# Altium schematic sheet Ejercicio1.SchDoc
size A3
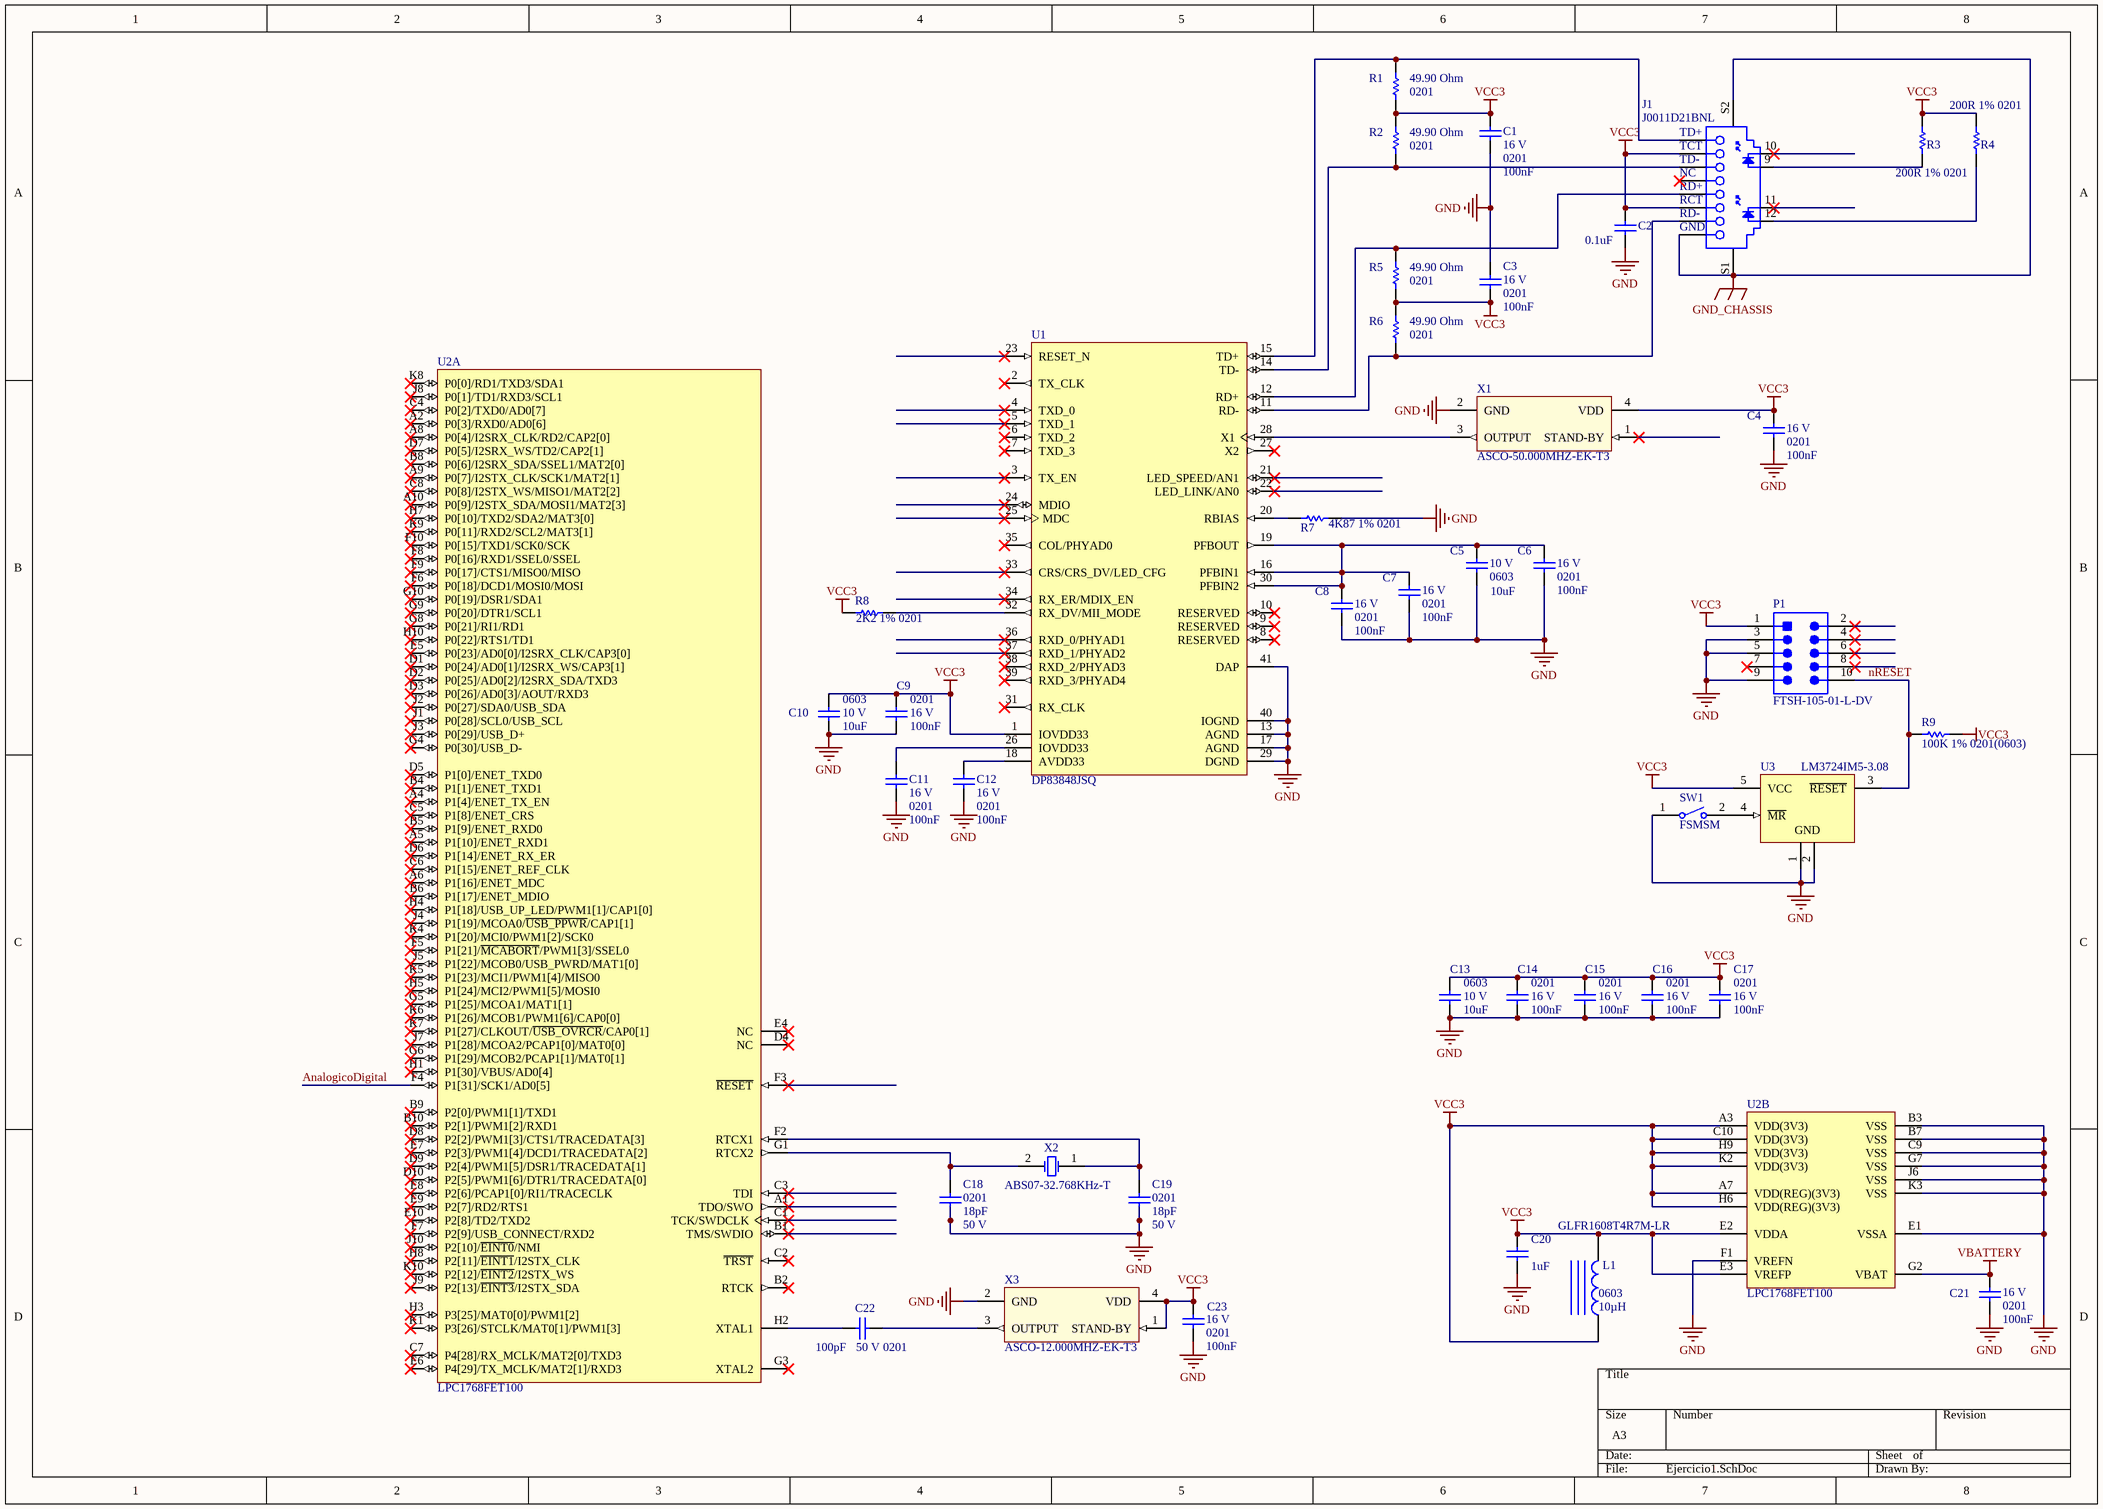
[diagram p0: Ejercicio1.SchDoc]

## Parts
C1  value 100nF  Rated Voltage: 16 V  Case-EIA: 0201  [CAPC0201(0603)33_N]  (hidden comment: CAP 100nF 16V 0201(0603))
C2  Capacitance: 0.1uF  [MURA-0603_H_0.9_L]  (hidden comment: GRM188R71C104KA01D)
C3  value 100nF  Rated Voltage: 16 V  Case-EIA: 0201  [CAPC0201(0603)33_N]  (hidden comment: CAP 100nF 16V 0201(0603))
C4  value 100nF  Rated Voltage: 16 V  Case-EIA: 0201  [CAPC0201(0603)33_N]  (hidden comment: CAP 100nF 16V 0201(0603))
C5  value 10uF  Rated Voltage: 10 V  Case-EIA: 0603  [CAPC0603(1608)100_N]  (hidden comment: CAP 10uF 10V 0603(1608))
C6  value 100nF  Rated Voltage: 16 V  Case-EIA: 0201  [CAPC0201(0603)33_N]  (hidden comment: CAP 100nF 16V 0201(0603))
C7  value 100nF  Rated Voltage: 16 V  Case-EIA: 0201  [CAPC0201(0603)33_N]  (hidden comment: CAP 100nF 16V 0201(0603))
C8  value 100nF  Rated Voltage: 16 V  Case-EIA: 0201  [CAPC0201(0603)33_N]  (hidden comment: CAP 100nF 16V 0201(0603))
C9  value 100nF  Rated Voltage: 16 V  Case-EIA: 0201  [CAPC0201(0603)33_N]  (hidden comment: CAP 100nF 16V 0201(0603))
C10  value 10uF  Rated Voltage: 10 V  Case-EIA: 0603  [CAPC0603(1608)100_N]  (hidden comment: CAP 10uF 10V 0603(1608))
C11  value 100nF  Rated Voltage: 16 V  Case-EIA: 0201  [CAPC0201(0603)33_N]  (hidden comment: CAP 100nF 16V 0201(0603))
C12  value 100nF  Rated Voltage: 16 V  Case-EIA: 0201  [CAPC0201(0603)33_N]  (hidden comment: CAP 100nF 16V 0201(0603))
C13  value 10uF  Rated Voltage: 10 V  Case-EIA: 0603  [CAPC0603(1608)100_N]  (hidden comment: CAP 10uF 10V 0603(1608))
C14  value 100nF  Rated Voltage: 16 V  Case-EIA: 0201  [CAPC0201(0603)33_N]  (hidden comment: CAP 100nF 16V 0201(0603))
C15  value 100nF  Rated Voltage: 16 V  Case-EIA: 0201  [CAPC0201(0603)33_N]  (hidden comment: CAP 100nF 16V 0201(0603))
C16  value 100nF  Rated Voltage: 16 V  Case-EIA: 0201  [CAPC0201(0603)33_N]  (hidden comment: CAP 100nF 16V 0201(0603))
C17  value 100nF  Rated Voltage: 16 V  Case-EIA: 0201  [CAPC0201(0603)33_N]  (hidden comment: CAP 100nF 16V 0201(0603))
C18  value 18pF  Case-EIA: 0201  Rated Voltage: 50 V  [CAPC0201(0603)33_M]  (hidden comment: CAP 18pF 50V 0201(0603))
C19  value 18pF  Case-EIA: 0201  Rated Voltage: 50 V  [CAPC0201(0603)33_M]  (hidden comment: CAP 18pF 50V 0201(0603))
C20  value 1uF  [CAPC0603(1608)100_N]  (hidden comment: CAP 1uF 50V 0603(1608))
C21  value 100nF  Rated Voltage: 16 V  Case-EIA: 0201  [CAPC0201(0603)33_N]  (hidden comment: CAP 100nF 16V 0201(0603))
C22  value 100pF  Rated Voltage: 50 V  Case-EIA: 0201  [CAPC0201(0603)33_M]  (hidden comment: CAP 100pF 50V 0201(0603))
C23  value 100nF  Rated Voltage: 16 V  Case-EIA: 0201  [CAPC0201(0603)33_N]  (hidden comment: CAP 100nF 16V 0201(0603))
J1  J0011D21BNL  [PULS-J00XXD21XNL-B-12]
L1  GLFR1608T4R7M-LR  Inductance: 10µH  Package Reference: 0603  [INDC1608X100X35NL20T15]
P1  FTSH-105-01-L-DV  [SMTC-FTSH-105-01-L-DV_V]
R1  value 49.90 Ohm  Case-EIA: 0201  [RESC0201(0603)_L]  (hidden comment: 49R9 1% 0201(0603))
R2  value 49.90 Ohm  Case-EIA: 0201  [RESC0201(0603)_L]  (hidden comment: 49R9 1% 0201(0603))
R3  200R 1% 0201  [RESC0201(0603)_M]
R4  200R 1% 0201  [RESC0201(0603)_M]
R5  value 49.90 Ohm  Case-EIA: 0201  [RESC0201(0603)_L]  (hidden comment: 49R9 1% 0201(0603))
R6  value 49.90 Ohm  Case-EIA: 0201  [RESC0201(0603)_L]  (hidden comment: 49R9 1% 0201(0603))
R7  4K87 1% 0201  [RESC0201(0603)_L]
R8  2K2 1% 0201  [RESC0201(0603)_N]
R9  100K 1% 0201(0603)  [RESC0201(0603)_L]
SW1  FSMSM  [TECO-FSMSM-2_V]
U1  DP83848JSQ  [SQA40B]
U2  LPC1768FET100  [SOT926-1]  (parts A,B of 2)
U3  LM3724IM5-3.08  [MF05A_N]
X1  ASCO-50.000MHZ-EK-T3  [ABRA-ASCO-50.000MHZ-EK-T3-4_V]
X2  ABS07-32.768KHz-T  [ABRA-ABS07-2_V]
X3  ASCO-12.000MHZ-EK-T3  [ABRA-ASCO-50.000MHZ-EK-T3-4_V]

## Nets
GND: C1.2 C2.1 C3.1 C4.2 C5.2 C6.2 C7.2 C8.2 C9.1 C10.1 C11.2 C12.2 C13.1 C14.1 C15.1 C16.1 C17.1 C18.1 C19.1 C20.1 C21.2 C23.2 P1.3 P1.5 P1.9 R7.2 SW1.1 U1.13(AGND) U1.17(AGND) U1.29(DGND) U1.40(IOGND) U1.41(DAP) U2.B3(VSS) U2.B7(VSS) U2.C9(VSS) U2.E1(VSSA) U2.F1(VREFN) U2.G7(VSS) U2.J6(VSS) U2.K3(VSS) U3.1(GND) U3.2(GND) X1.2(GND) X3.2(GND)
GND_CHASSIS: J1.8(CHS_GROUND) J1.S1 J1.S2
VBATTERY: C21.1 U2.G2(VBAT)
VCC3: C1.1 C2.2 C3.2 C4.1 C9.2 C10.2 C13.2 C14.2 C15.2 C16.2 C17.2 C20.2 C23.1 J1.4(TCT) J1.5(RCT) L1.1 L1.2 P1.1 R1.1 R2.2 R3.2 R4.2 R5.1 R6.2 R8.2 R9.1 U1.1(IOVDD33) U2.A3(VDD(3V3)) U2.A7(VDD(REG)(3V3)) U2.C10(VDD(3V3)) U2.E2(VDDA) U2.E3(VREFP) U2.H6(VDD(REG)(3V3)) U2.H9(VDD(3V3)) U2.K2(VDD(3V3)) U3.5(VCC) X1.4(VDD) X3.1(STAND-BY) X3.4(VDD)
AnalogicoDigital: U2.F4(P1[31]/SCK1/AD0[5])
nRESET: P1.10 R9.2 U3.3(~{RESET})
NetC5_1: C5.1 C6.1 C7.1 C8.1 U1.16(PFBIN1) U1.19(PFBOUT) U1.30(PFBIN2)
NetC11_1: C11.1 U1.26(IOVDD33)
NetC12_1: C12.1 U1.18(AVDD33)
NetC18_2: C18.2 U2.G1(RTCX2) X2.2(X2)
NetC19_2: C19.2 U2.F2(RTCX1) X2.1(X1)
NetC22_1: C22.1 X3.3(OUTPUT)
NetC22_2: C22.2 U2.H2(XTAL1)
NetJ1_1: J1.1(TD+) R1.2 U1.15(TD+)
NetJ1_2: J1.2(TD-) R2.1 U1.14(TD-)
NetJ1_3: J1.3(RD+) R5.2 U1.12(RD+)
NetJ1_6: J1.6(RD-) R6.1 U1.11(RD-)
NetJ1_9: J1.9 R3.1
NetJ1_12: J1.12 R4.1
NetR7_1: R7.1 U1.20(RBIAS)
NetR8_1: R8.1 U1.32(RX_DV/MII_MODE)
NetSW1_2: SW1.2 U3.4(~{MR})
NetU1_28: U1.28(X1) X1.3(OUTPUT)

Not connected (* = marked no-connect by the designer): J1 7(NC)* 10* 11*; P1 2* 4* 6* 7* 8*; U1 2(TX_CLK)* 3(TX_EN)* 4(TXD_0)* 5(TXD_1)* 6(TXD_2)* 7(TXD_3)* 8(RESERVED)* 9(RESERVED)* 10(RESERVED)* 21(LED_SPEED/AN1)* 22(LED_LINK/AN0)* 23(RESET_N)* 24(MDIO)* 25(MDC)* 27(X2)* 31(RX_CLK)* 33(CRS/CRS_DV/LED_CFG)* 34(RX_ER/MDIX_EN)* 35(COL/PHYAD0)* 36(RXD_0/PHYAD1)* 37(RXD_1/PHYAD2)* 38(RXD_2/PHYAD3)* 39(RXD_3/PHYAD4)*; U2 A1(TDO/SWO)* A2(P0[3]/RXD0/AD0[6])* A4(P1[4]/ENET_TX_EN)* A5(P1[10]/ENET_RXD1)* A6(P1[16]/ENET_MDC)* A8(P0[4]/I2SRX_CLK/RD2/CAP2[0])* A9(P0[7]/I2STX_CLK/SCK1/MAT2[1])* A10(P0[9]/I2STX_SDA/MOSI1/MAT2[3])* B1(TMS/SWDIO)* B2(RTCK)* B4(P1[1]/ENET_TXD1)* B5(P1[9]/ENET_RXD0)* B6(P1[17]/ENET_MDIO)* B8(P0[6]/I2SRX_SDA/SSEL1/MAT2[0])* B9(P2[0]/PWM1[1]/TXD1)* B10(P2[1]/PWM1[2]/RXD1)* C1(TCK/SWDCLK)* C2(~{TRST})* C3(TDI)* C4(P0[2]/TXD0/AD0[7])* C5(P1[8]/ENET_CRS)* C6(P1[15]/ENET_REF_CLK)* C7(P4[28]/RX_MCLK/MAT2[0]/TXD3)* C8(P0[8]/I2STX_WS/MISO1/MAT2[2])* D1(P0[24]/AD0[1]/I2SRX_WS/CAP3[1])* D2(P0[25]/AD0[2]/I2SRX_SDA/TXD3)* D3(P0[26]/AD0[3]/AOUT/RXD3)* D4(NC)* D5(P1[0]/ENET_TXD0)* D6(P1[14]/ENET_RX_ER)* D7(P0[5]/I2SRX_WS/TD2/CAP2[1])* D8(P2[2]/PWM1[3]/CTS1/TRACEDATA[3])* D9(P2[4]/PWM1[5]/DSR1/TRACEDATA[1])* D10(P2[5]/PWM1[6]/DTR1/TRACEDATA[0])* E4(NC)* E5(P0[23]/AD0[0]/I2SRX_CLK/CAP3[0])* E6(P4[29]/TX_MCLK/MAT2[1]/RXD3)* E7(P2[3]/PWM1[4]/DCD1/TRACEDATA[2])* E8(P2[6]/PCAP1[0]/RI1/TRACECLK)* E9(P2[7]/RD2/RTS1)* E10(P2[8]/TD2/TXD2)* F3(~{RESET})* F5(P1[21]/~{MCABORT}/PWM1[3]/SSEL0)* F6(P0[18]/DCD1/MOSI0/MOSI)* F7(P2[9]/USB_CONNECT/RXD2)* F8(P0[16]/RXD1/SSEL0/SSEL)* F9(P0[17]/CTS1/MISO0/MISO)* F10(P0[15]/TXD1/SCK0/SCK)* G3(XTAL2)* G4(P0[30]/USB_D-)* G5(P1[25]/MCOA1/MAT1[1])* G6(P1[29]/MCOB2/PCAP1[1]/MAT0[1])* G8(P0[21]/RI1/RD1)* G9(P0[20]/DTR1/SCL1)* G10(P0[19]/DSR1/SDA1)* H1(P1[30]/VBUS/AD0[4])* H3(P3[25]/MAT0[0]/PWM1[2])* H4(P1[18]/USB_UP_LED/PWM1[1]/CAP1[0])* H5(P1[24]/MCI2/PWM1[5]/MOSI0)* H7(P0[10]/TXD2/SDA2/MAT3[0])* H8(P2[11]/~{EINT1}/I2STX_CLK)* H10(P0[22]/RTS1/TD1)* J1(P0[28]/SCL0/USB_SCL)* J2(P0[27]/SDA0/USB_SDA)* J3(P0[29]/USB_D+)* J4(P1[19]/MCOA0/~{USB_PPWR}/CAP1[1])* J5(P1[22]/MCOB0/USB_PWRD/MAT1[0])* J7(P1[28]/MCOA2/PCAP1[0]/MAT0[0])* J8(P0[1]/TD1/RXD3/SCL1)* J9(P2[13]/~{EINT3}/I2STX_SDA)* J10(P2[10]/~{EINT0}/NMI)* K1(P3[26]/STCLK/MAT0[1]/PWM1[3])* K4(P1[20]/MCI0/PWM1[2]/SCK0)* K5(P1[23]/MCI1/PWM1[4]/MISO0)* K6(P1[26]/MCOB1/PWM1[6]/CAP0[0])* K7(P1[27]/CLKOUT/~{USB_OVRCR}/CAP0[1])* K8(P0[0]/RD1/TXD3/SDA1)* K9(P0[11]/RXD2/SCL2/MAT3[1])* K10(P2[12]/~{EINT2}/I2STX_WS)*; X1 1(STAND-BY)*

## Notes on the sheet
- (in symbol CMP-2000-05321-1) GND

## Library data of the parts
C1 C3 C4 C6-C9 C11 C12 C14-C17 C21 C23 = CMP-1033-00663-1: CAP 100nF 16V ±10% 0201 (0603 Metric) Thickness 0.33mm SMD; Case-Metric: 0603; Tolerance: Â±10%; Max Thickness: 0.33 mm; Technology: SMT
C2 = CMP-2000-05253-1: CAP, Ceramic, 0.1 uF, 10%, 16 V, 0603, RoHS, Tape and Reel; Manufacturer: Murata; Capacitance - pF: 100000pF; Case Length: 1.6mm; Voltage Rating DC: 16V; Brand: MurataElectronics; Temperature Coefficient / Code: +/-15%; Case Width: 0.8mm; Type: GeneralPurposeMLCC; Dielectric: X7R; Capacitance - nF: 100nF; Product Category: MultilayerCeramicCapacitorsMLCC-SMD/SMT; Datasheet URL: https://datasheet.ciiva.com/29202/451467-da-01-en-vs-kondensator-0603-29202287.pdf; Termination Style: SMD/SMT; Operating Temperature Range: -55Cto+125C; Case Code - in: 0603; Datasheet Version: Dec-10; Dimensions: 0.8mmWx1.6mmLx0.8mmH; RoHS: Details; Case Code - mm: 1608; Product: GeneralTypeMLCCs; Voltage Rating: 16V; Package / Case: 0603(1608metric); Factory Pack Quantity: 4000; Packaging: Reel; Maximum Operating Temperature: +125C; Manufacturer URL: http://www.murata.com/; Case Height: 0.8mm; Minimum Operating Temperature: -55C; Series: GRM; Tolerance: 10%
C5 C10 C13 = CMP-1035-02799-1: CAP 10uF 10V ±10% 0603 (1608 Metric) Thickness 1mm SMD; Tolerance: Â±10%; Case-Metric: 1608; Max Thickness: 1 mm; Technology: SMT
C18 C19 = CMP-1033-00395-1: CAP 18pF 50V ±2% 0201 (0603 Metric) Thickness 0.33mm SMD; Tolerance: Â±2%; Case-Metric: 0603; Technology: SMT; Max Thickness: 0.33 mm
C20 = CMP-1035-02746-1: CAP 1uF 50V ±20% 0603 (1608 Metric) Thickness 1mm SMD; Tolerance: Â±20%; Case-EIA: 0603; Case-Metric: 1608; Technology: SMT; Max Thickness: 1 mm; Rated Voltage: 50 V
C22 = CMP-1033-00496-1: CAP 100pF 50V ±2% 0201 (0603 Metric) Thickness 0.33mm SMD; Tolerance: Â±2%; Case-Metric: 0603; Max Thickness: 0.33 mm; Technology: SMT
J1 = CMP-2000-05321-1: 10/100 Base-TX RJ45 1 x 1 Tab-Down with LEDs Integrated Magnetics Connector, 0 to 70 degC, 12-Pin THD, RoHS, Tube; Manufacturer: Pulse; Body Orientation: RightAngle; Number of Contacts: 8; Gender: F; Pitch: 2.54mm; Category: ConnectorTelephoneandTelecom; Package Description: 12-Pin Through Hole Device, Body 16.26 x 21.59 mm, Pitch 1.27 mm; Datasheet Version: Rev. D, 05/2006; Termination Method: Solder; Type: RJ-45; Package Reference: J0011D21BNL; Manufacturer URL: http://www.pulseelectronics.com/; Mounting: ThroughHole; Datasheet URL: http://datasheet.octopart.com/J0011D21BNL-Pulse-datasheet-120436.pdf
L1 = CMP-2000-06322-1: Chip Inductor, 4.7 uH, +/- 20%, -40 to 105 degC, 0603 (1608 Metric), RoHS, Tape and Reel; Manufacturer: TDK; DC Resistance (DCR): 240mOhm; Dynamic Catalog: GLFRSeries; Catalog Drawings: 1608(0603)Top / 1608(0603)Side; Other Names: 445-3607-2; Other Related Documents: 1608(0603)Footprint; Current Rating: 110mA; Shielding: Shielded; Current - Saturation: 170mA; Mounting Technology: SurfaceMount; Manufacturer URL: http://www.tdk.com/; Family: FixedInductors; Datasheet URL: http://media.digikey.com/pdf/Data%20Sheets/TDK%20PDFs/GLFR%20Series.pdf; Package / Case: 0603(1608Metric); Package Description: 2-Pin Surface Mount Device, Body 1.6 x 0.8 mm; Standard Package: 4,000; Mounting Type: SurfaceMount; Category: Inductors,Coils,Chokes; Series: GLFR; Datasheet Version: 07/2008; Operating Temperature: -40°C~105°C; Packaging: Tape&Reel(TR); Tolerance: ±20%; Size / Dimension: 0.063"Lx0.031"Wx0.031"H(1.60mmx0.80mmx0.80mm)
P1 = CMP-2000-05354-1: Male Header, Pitch 1.27 mm, 2 x 5 Position, Height 5.96 mm, -55 to 125 degC, RoHS, Bulk; Manufacturer: Samtec; Connector Type: Header,Unshrouded; Pitch: 0.050"(1.27mm); Mating Products: FLE-105-01-G-DV-TR-ND-CONNSKT1.27MM10POSDUALSMDCLP-105-02-G-D-P-TR-ND-CONNRCPT10POSDUAL.05"SMDSFMC-105-L2-S-D-TR-ND-CONN.05"SURFACE10POSSMTSFMH-105-02-L-D-TR-ND-CONNRECEPT10POS.50"SMTFLE-105-01-G-DV-A-ND-CONNSKT1.27MM10POSDUALSMDCLP-105-02-G-D-BE-ND-CONNRCPT10POSDUAL.05"SMDFLE-105-01-G-DV-A-P-ND-CONNSKT1.27MM10POSDUALSMDSAM1153-05-ND-CONNRCPT10POSDUAL.05"SMDSAM1155-05-ND-CONNRCPT10POSDUAL.05"SMDSAM1154-05-ND-CONNRCPT10POSDUAL.05"SMDSFMH-105-02-L-D-LC-ND-CONNRECEPT10POS.50"SMTSAM1226-05-ND-CONNRCPT.05"10POSDUALSMD; Catalog Drawings: FTSHSeriesFTSHSeriesSMTSide; Other Names: SAM1161-05; EDA / CAD Models: DownloadfromAcceleratedDesigns; Number of Positions Loaded: All; Number of Positions: 10; Featured Product: Board-To-BoardInterconnectSystems; Online Catalog: FTSHSeries; Product Training Modules: Board-to-BoardConnectors; Category: Connectors,Interconnects; Number of Rows: 2; Contact Finish: Gold; Termination: Solder; Mounting Type: SurfaceMount; Series: FTSH; Contact Mating Length: 0.120"(3.05mm); Row Spacing: 0.050"(1.27mm); Datasheet URL: https://datasheet.ciiva.com/30493/0900766b80adfe36-30493006.pdf; Contact Finish Thickness: 10µin(0.25µm); Features: -; Standard Package: 1; Packaging: Bulk; Datasheet Version: Feb-08; Manufacturer URL: http://www.samtec.com/; Fastening Type: -; Family: RectangularConnectors-Headers,MalePins; Contact Type: MalePin; Color: Black
R1 R2 R5 R6 = CMP-1010-00269-1: 49R9 0.05W 1% 0201 (0603 Metric)  SMD; Case-Metric: 0603; Power: 0.05 W; Technology: SMT; Tolerance: 1 %
R3 R4 = CMP-1010-00335-1: 200R 0.05W 1% 0201 (0603 Metric)  SMD; Case-Metric: 0603; Case-EIA: 0201; Value: 200.00 Ohm; Power: 0.05 W; Technology: SMT; Tolerance: 1 %
R7 = CMP-1010-00494-1: 4K87 0.05W 1% 0201 (0603 Metric)  SMD; Value: 4870.00 Ohm; Case-EIA: 0201; Case-Metric: 0603; Power: 0.05 W; Technology: SMT; Tolerance: 1 %
R8 = CMP-1010-00452-1: 2K2 0.05W 1% 0201 (0603 Metric)  SMD; Case-EIA: 0201; Case-Metric: 0603; Value: 2200.00 Ohm; Tolerance: 1 %; Power: 0.05 W; Technology: SMT
R9 = CMP-1010-00565-1: 22K 0.05W 1% 0201 (0603 Metric)  SMD; Value: 22000.00 Ohm; Case-Metric: 0603; Case-EIA: 0201; Power: 0.05 W; Tolerance: 1 %; Technology: SMT
SW1 = CMP-2000-07511-1: FSMSM Push Button Switch, 50 mA, -35 to 85 degC, 2-Pin SMD, RoHS, Bulk; Manufacturer: TE Connectivity; Actuator Length: 1.07mm; Electrical Life: 20000Cycles; Actuator Material: Polyamide; Current Rating: 50mA; Illumination Type: Illuminated; Voltage Rating (DC): 24V; Contact Resistance: 100mOhm; Case\/Package: SMD/SMT; Operating Force: 180gf; Switch Travel: 0.25mm; Max Voltage Rating (DC): 12V; Throw Configuration: SPST; Packaging: LoosePiece; Max Operating Temperature: 85degC; ELV: Compliant; Package Description: 2-Pin Surface Mount Device, Body 6 x 3.5 mm, Pitch 9.19 mm; RoHSCompliant: true; Manufacturer URL: http://www.te.com/; Contact Plating: Silver; Contact Material: Brass; Mounting Technology: SurfaceMount; Contact Current Rating: 50mA; Datasheet Version: Rev. C2, 08/2014; Datasheet URL: http://www.te.com/commerce/DocumentDelivery/DDEController?Action=showdoc&DocId=Customer+Drawing%7F1437566-3%7FC2%7Fpdf%7FEnglish%7FENG_CD_1437566-3_C2_1437566_3_1_c.dwg.pdf%7F1437566-3; Mechanical Life: 20000Cycles; Package Reference: FSMSM; REACH SVHC: Unknown; Orientation: Straight; Min Operating Temperature: -35degC; Lead Free: LeadFree; Termination: GullWing; Package Quantity: 1000; Mount: SurfaceMount
U1 = CMP-0058-00374-3: PHYTER® Mini LS Commercial Temperature Single Port 10/100 Mb/s Ethernet Transceiver, 40-pin LLP; Manufacturer: National Semiconductor; CompType: Interface IC; High-Reliability: Y; PowerWise: N; PackageTopMarking: NS*UZXYTT*83848JSQ; PackageReference: SQA40B; PinCount: 40; PackageVersion: revA, Mar-2004; ComponentLink4Description: SQA40B Package Page; RoHS: Y; ComponentLink2Description: DP83848J Datasheet; PackageDescription: LLP, Quad, 6 x 6 x 0.8mm, 40 Lead, Small DAP, 0.5mm Pitch, No Pullback; DatasheetVersion: May-2008; ComponentLink3Description: DP83848J Web Page; ComponentLink3URL: http://www.national.com/pf/DP/DP83848J.html; PartNumber: DP83848JSQ; ComponentLink1Description: Manufacturer URL; ComponentLink1URL: http://www.national.com/; RevisionNote: Type for pins 21 & 22 corrected to I/O; ComponentLink2URL: http://www.national.com/ds/DP/DP83848J.pdf; ComponentLink4URL: http://www.national.com/packaging/folders/sqa40b.html
U2 = CMP-0174-00003-3: Cortex-M3, 32-Bit ARM MCU, 512 kB flash, 64 kB SRAM, Ethernet, USB 2.0 Device/Host/OTG, 12-Bit ADC, DAC, I2S, 100-Pin TFBGA; SPI: 1; VDD (max): 3.6 V; fmax: 100 MHz; PLL: Y; VDD (min): 2.4 V; VDD (typ): 3.3 V; Flash: 512 kB; SRAM: 64 kB; SSP: 2; ADC channels: 8; PWM: 6; GPIOs: 70; UART: 4; PartNumber: LPC1768FET100; ComponentLink2Description: Datasheet; ComponentLink1Description: Manufacturer URL; ComponentLink1URL: http://www.nxp.com/; PackageReference: SOT926-1; ComponentLink2URL: http://www.nxp.com/documents/data_sheet/LPC1769_68_67_66_65_64_63.pdf; USB: 1; DatasheetVersion: Rev. 8, Nov-2011; PackageDescription: TFBGA100: Plastic Thin Fine-Pitch Ball Grid Array Package; 100 Balls; Body 9 x 9 x 0.7 mm; CAN: 2; PackageVersion: 38708; Timers: 4
U3 = CMP-0063-01084-2: Microprocessor Reset Circuits, 5-pin SOT-23; Manufacturer: National Semiconductor; CompType: MiscPower; PackageTopMarking: R53B*XTT; PowerWise: N; ComponentLink2Description: LM3724 Web Page; RevisionNote: Component URLs added; DatasheetVersion: Jul-2007; PackageReference: MF05A; RoHS: N; PackageVersion: revD, Aug-2008; PackageDescription: Molded SOT-23, .115 x .063 x .040 in Body, 5 Lead, .0375 in Pitch; ComponentLink2URL: http://www.national.com/pf/LM/LM3724.html; ComponentLink3URL: http://www.national.com/packaging/folders/mf05a.html; ComponentLink1URL: http://www.national.com/ds/LM/LM3724.pdf; ComponentLink1Description: LM3724 Datasheet; PinCount: 5; ComponentLink3Description: MF05A Package Page
X1 = CMP-0461-00001-3: Crystal Clock Oscillator, 50 MHz, -20 to 70 degC, 1.6 x 1.2 x 0.7 mm SMD; Manufacturer: Abracon; Frequency(MHz): 50; Aging: -3 to 3 3 ppm; Packing: Tape and Reel; Overall Frequency Stability: +/-30 ppm; Supply Current (Idd)
into 15pF Load: 6 mA; Supply Voltage (Vdd): 3.3 V; Output Load: 15 pF; ComponentLink2Description: Datasheet; ComponentLink3Description: Package Specification; ComponentLink3URL: http://www.abracon.com/Oscillators/ASCO.pdf; ComponentLink2URL: http://www.abracon.com/Oscillators/ASCO.pdf; Mounting Technology: Surface Mount; PackageDescription: 4-Pin Hand Drawn, Body 1.6 x 1.2 mm; DatasheetVersion: 01.25.13; ComponentLink1Description: Manufacturer URL; PartNumber: ASCO-50.000MHZ-EK-T3; Operating temperature: -20 to 70 degC; ComponentLink1URL: http://www.abracon.com; PackageReference: ASCO-50.000MHZ-EK-T3-4
X2 = CMP-0447-00001-2: Crystal, 32.768 kHz, 12.5 pF, -40 to 85 degC, SMD Low Profile 3.2 x 1.5 x 0.9 mm, Tape and Reel; Manufacturer: Abracon; Q Value (Type): 30000; Operation Mode: Flexural Mode (Tuning Fork); Shunt Capacitance (C0): 0.9 to 1.2 pF; Load Capacitance (CL): 12.5 pF; Frequency Tolerance @+25degC: +/- 20 ppm; Drive Level (Type): 0.1 uW; Equivalent Series Resistance (R1): 70 Kohm; Insulation Resistance (Min): 500 Mohm; ComponentLink3URL: http://www.abracon.com/Resonators/ABS07.pdf; PackageDescription: 2-Pin Hand Drawn, Body 3.2x1.5mm, Pitch 2.5mm; Operating Temperature: -40 to 85 degC; ComponentLink2URL: http://www.abracon.com/Resonators/ABS07.pdf; PackageReference: ABS07-2; ComponentLink3Description: Package Specification; ComponentLink1Description: Manufacturer URL; DatasheetVersion: 04.03.13; Mounting Technology: Surface Mount; ComponentLink2Description: Datasheet; ComponentLink1URL: http://www.abracon.com/; PartNumber: ABS07-32.768KHz-T; Packing: Tape and Reel; Frequency: 32.768 kHz
X3 = CMP-0461-00001-3: Crystal Clock Oscillator, 50 MHz, -20 to 70 degC, 1.6 x 1.2 x 0.7 mm SMD; Manufacturer: Abracon; PartNumber: ASCO-50.000MHZ-EK-T3; Frequency(MHz): 12; Aging: -3 to 3 3 ppm; Packing: Tape and Reel; Overall Frequency Stability: +/-30 ppm; Supply Current (Idd)
into 15pF Load: 6 mA; Supply Voltage (Vdd): 3.3 V; Output Load: 15 pF; ComponentLink2Description: Datasheet; ComponentLink3Description: Package Specification; ComponentLink3URL: http://www.abracon.com/Oscillators/ASCO.pdf; ComponentLink2URL: http://www.abracon.com/Oscillators/ASCO.pdf; Mounting Technology: Surface Mount; PackageDescription: 4-Pin Hand Drawn, Body 1.6 x 1.2 mm; DatasheetVersion: 01.25.13; ComponentLink1Description: Manufacturer URL; Operating temperature: -20 to 70 degC; ComponentLink1URL: http://www.abracon.com; PackageReference: ASCO-50.000MHZ-EK-T3-4